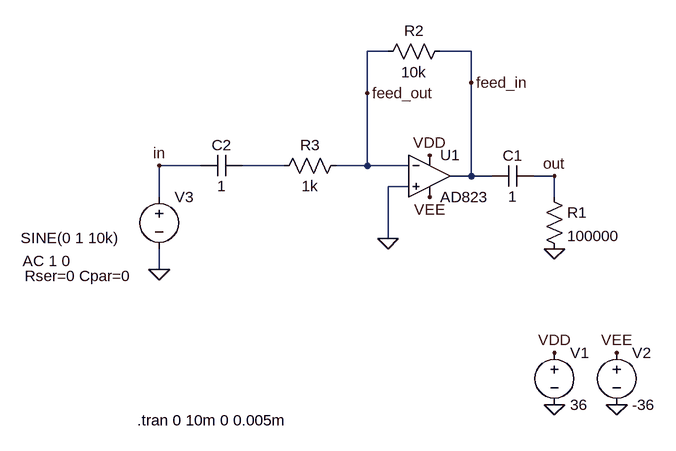
[diagram p0: schematic opamp.asc]
opamp.asc, the LTspice schematic file:
Version 4
SHEET 1 880 680
WIRE 112 -32 80 -32
WIRE 240 -32 192 -32
WIRE 240 16 240 -32
WIRE 80 32 80 -32
WIRE -176 144 -240 144
WIRE -48 144 -112 144
WIRE 80 144 80 32
WIRE 80 144 32 144
WIRE 144 144 80 144
WIRE 240 160 240 16
WIRE 240 160 208 160
WIRE 272 160 240 160
WIRE 368 160 336 160
WIRE 144 176 112 176
WIRE -240 192 -240 144
WIRE 368 192 368 160
WIRE 112 256 112 176
WIRE -240 304 -240 272
FLAG 368 512 0
FLAG 464 512 0
FLAG 368 432 VDD
FLAG 464 432 VEE
FLAG 176 128 VDD
FLAG 176 192 VEE
FLAG 368 272 0
FLAG 112 256 0
FLAG -240 304 0
FLAG -240 144 in
FLAG 368 160 out
FLAG 240 16 feed_in
FLAG 80 32 feed_out
SYMBOL OpAmps\\AD823 176 96 R0
SYMATTR InstName U1
SYMBOL voltage 368 416 R0
WINDOW 123 0 0 Left 0
WINDOW 39 0 0 Left 0
SYMATTR InstName V1
SYMATTR Value 36
SYMBOL voltage 464 416 R0
WINDOW 123 0 0 Left 0
WINDOW 39 0 0 Left 0
SYMATTR InstName V2
SYMATTR Value -36
SYMBOL cap 336 144 R90
WINDOW 0 0 32 VBottom 2
WINDOW 3 32 32 VTop 2
SYMATTR InstName C1
SYMATTR Value 1
SYMBOL res 352 176 R0
SYMATTR InstName R1
SYMATTR Value 100000
SYMBOL res 208 -48 R90
WINDOW 0 0 56 VBottom 2
WINDOW 3 32 56 VTop 2
SYMATTR InstName R2
SYMATTR Value 10k
SYMBOL res 48 128 R90
WINDOW 0 0 56 VBottom 2
WINDOW 3 32 56 VTop 2
SYMATTR InstName R3
SYMATTR Value 1k
SYMBOL cap -112 128 R90
WINDOW 0 0 32 VBottom 2
WINDOW 3 32 32 VTop 2
SYMATTR InstName C2
SYMATTR Value 1
SYMBOL voltage -240 176 R0
WINDOW 3 -213 79 Left 2
WINDOW 123 -210 115 Left 2
WINDOW 39 -207 138 Left 2
SYMATTR InstName V3
SYMATTR Value SINE(0 1 10k)
SYMATTR Value2 AC 1 0
SYMATTR SpiceLine Rser=0 Cpar=0
TEXT -274 536 Left 2 !.tran 0 10m 0 0.005m

The netlist it stands for:
* opamp.asc
XU1 0 feed_out VDD VEE feed_in AD823  ; pins In+ In- V+ V- OUT
V1 VDD 0 36
V2 VEE 0 -36
C1 out feed_in 1
R1 out 0 100000
R2 feed_in feed_out 10k
R3 feed_out N001 1k
C2 N001 in 1
V3 in 0 SINE(0 1 10k) AC 1 0 Rser=0 Cpar=0
.tran 0 10m 0 0.005m
.lib ADI.lib
.backanno
.end